# EAGLE schematic cmos_inverter (EAGLE 6.4)
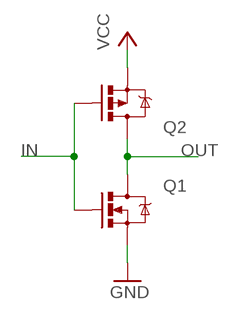
[diagram p0: schematic, sheet 1]

## Parts
Q1  MOSFET-NCHANNEL2N7000  [TO-92]
Q2  MOSFET-PCHANNELSMD  [SOT23-3]

## Nets
GND: Q1.1(S)
IN: Q1.2(G) Q2.1(G)
OUT: Q1.3(D) Q2.3(D)
VCC: Q2.2(S)

## Library data of the parts
Q1 = SparkFun-DiscreteSemi:MOSFET-NCHANNEL: Common NMOSFET Parts MFG P/N Store ID Prod ID FDD8780 TRANS-09984 SI7820DN TRANS-11055 FDS6630A IC-08089 2N7002PW TRANS-11151 FQP30N06L COM-10213 TRANS-10060 BSS123LT1G TRANS-08345 BSS138 TRANS-00830 BS170 2N7000
Q2 = SparkFun-DiscreteSemi:MOSFET-PCHANNEL: Generic PMOSFET